# EAGLE board BMS_Master (EAGLE 6.6.0)
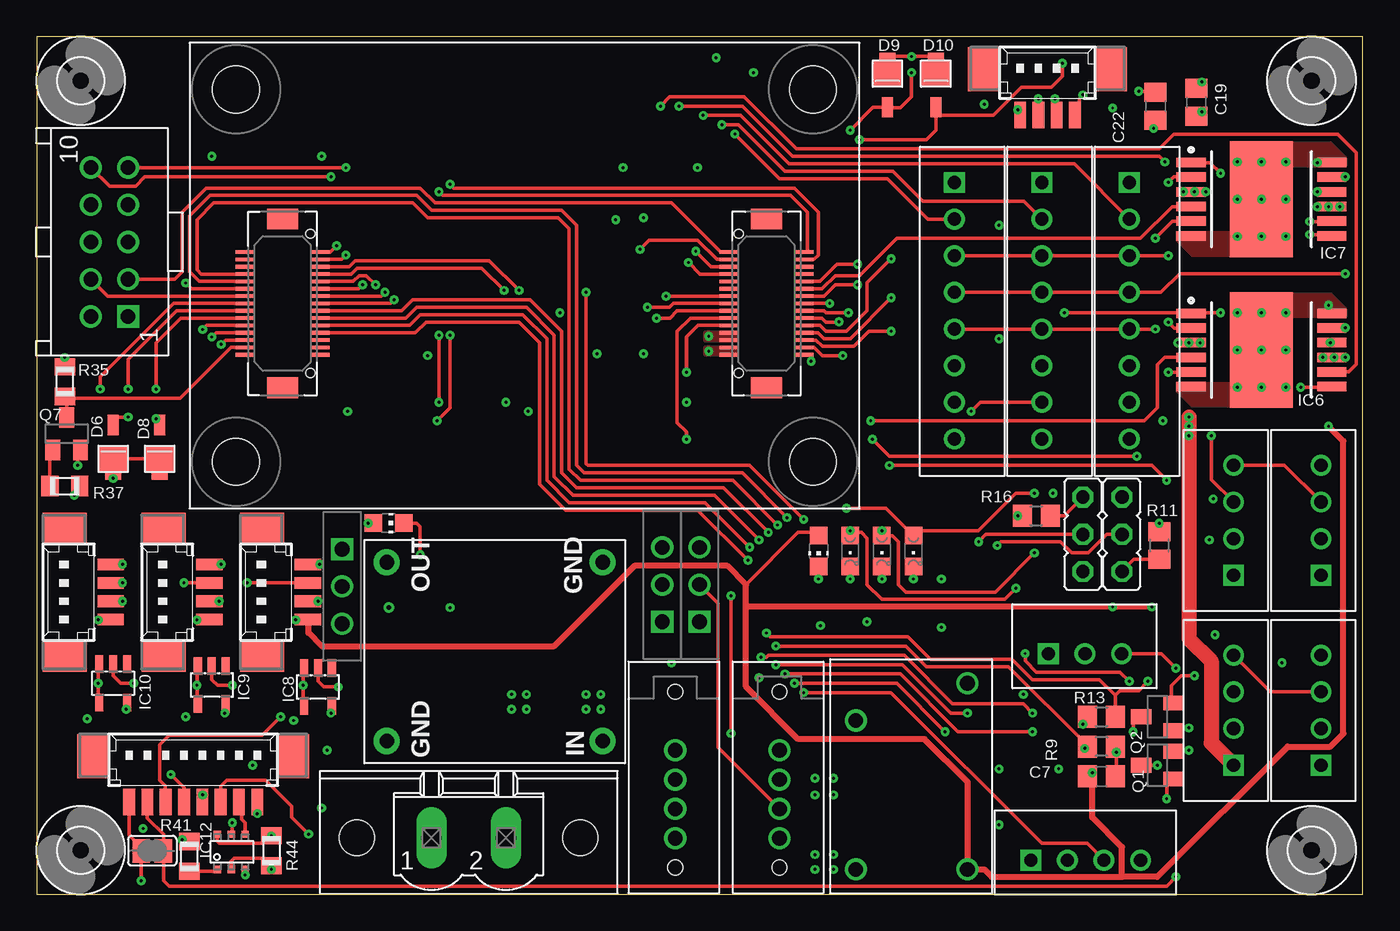
[diagram p6: board, top side]
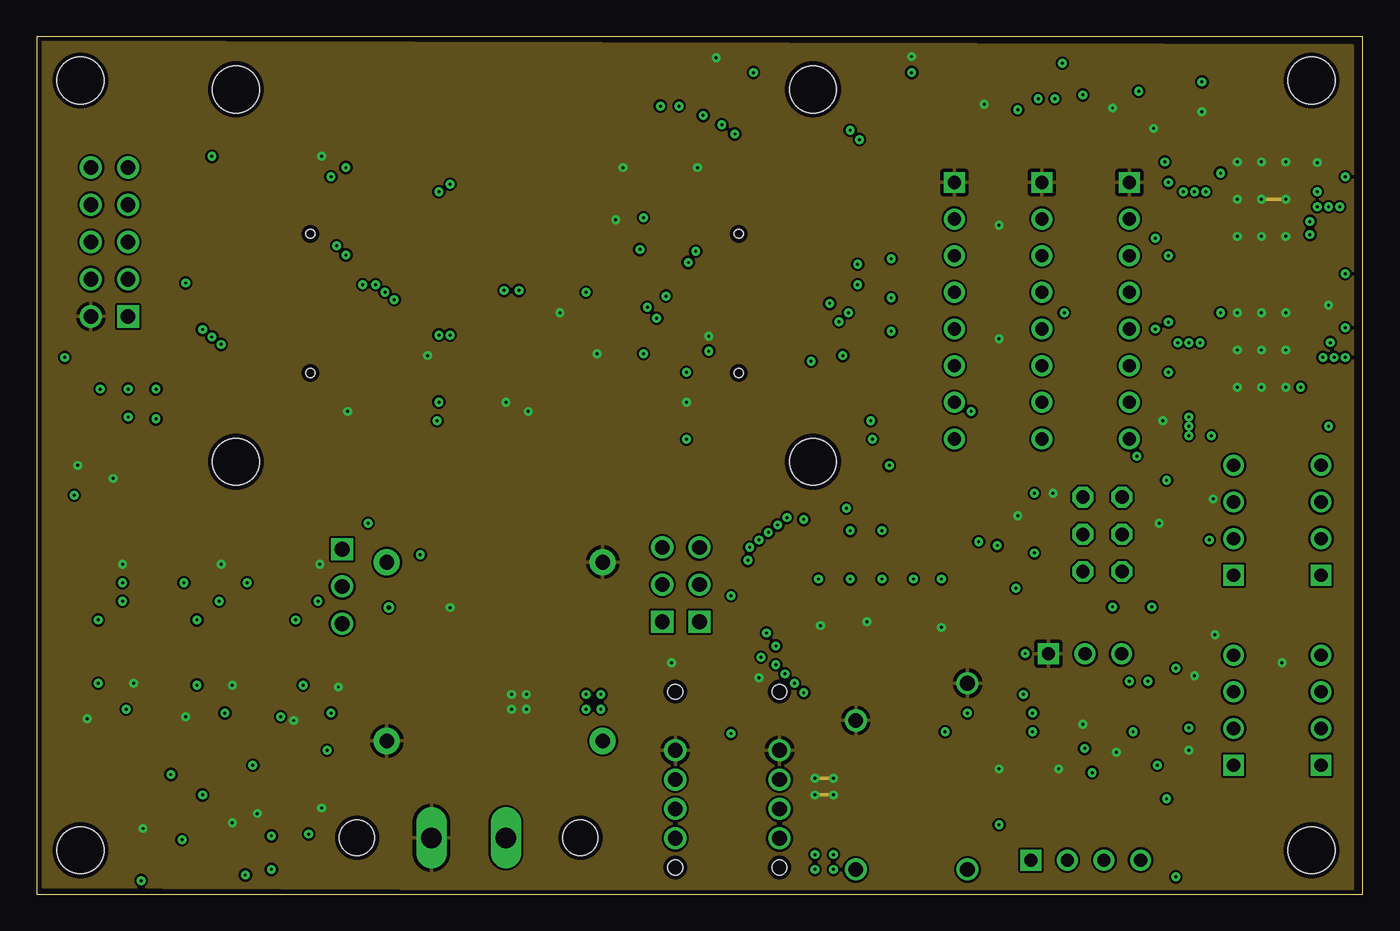
[diagram p7: board, inner layer Route2]
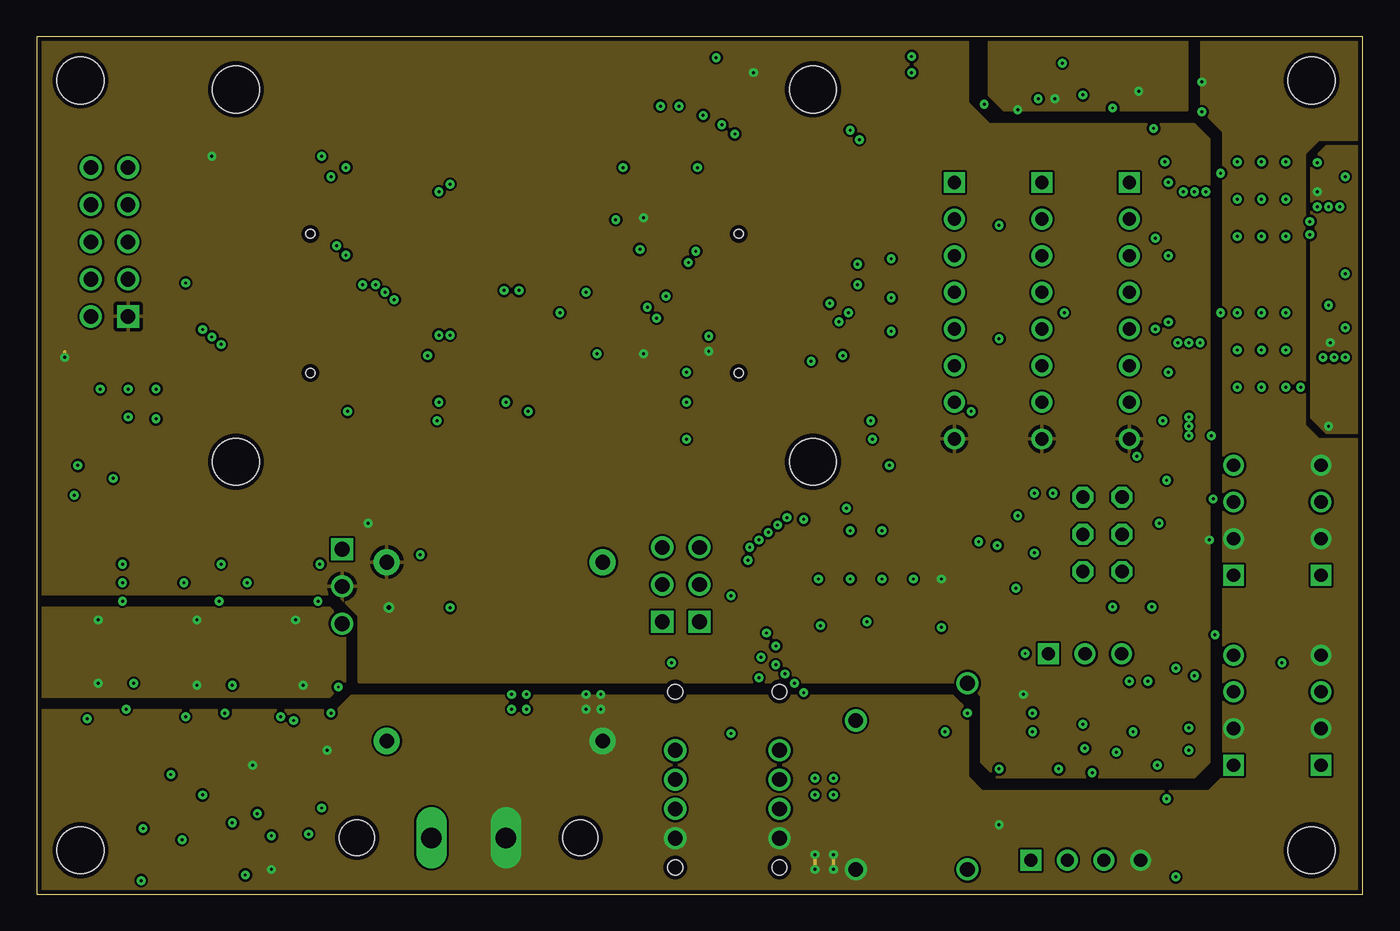
[diagram p8: board, inner layer Route15]
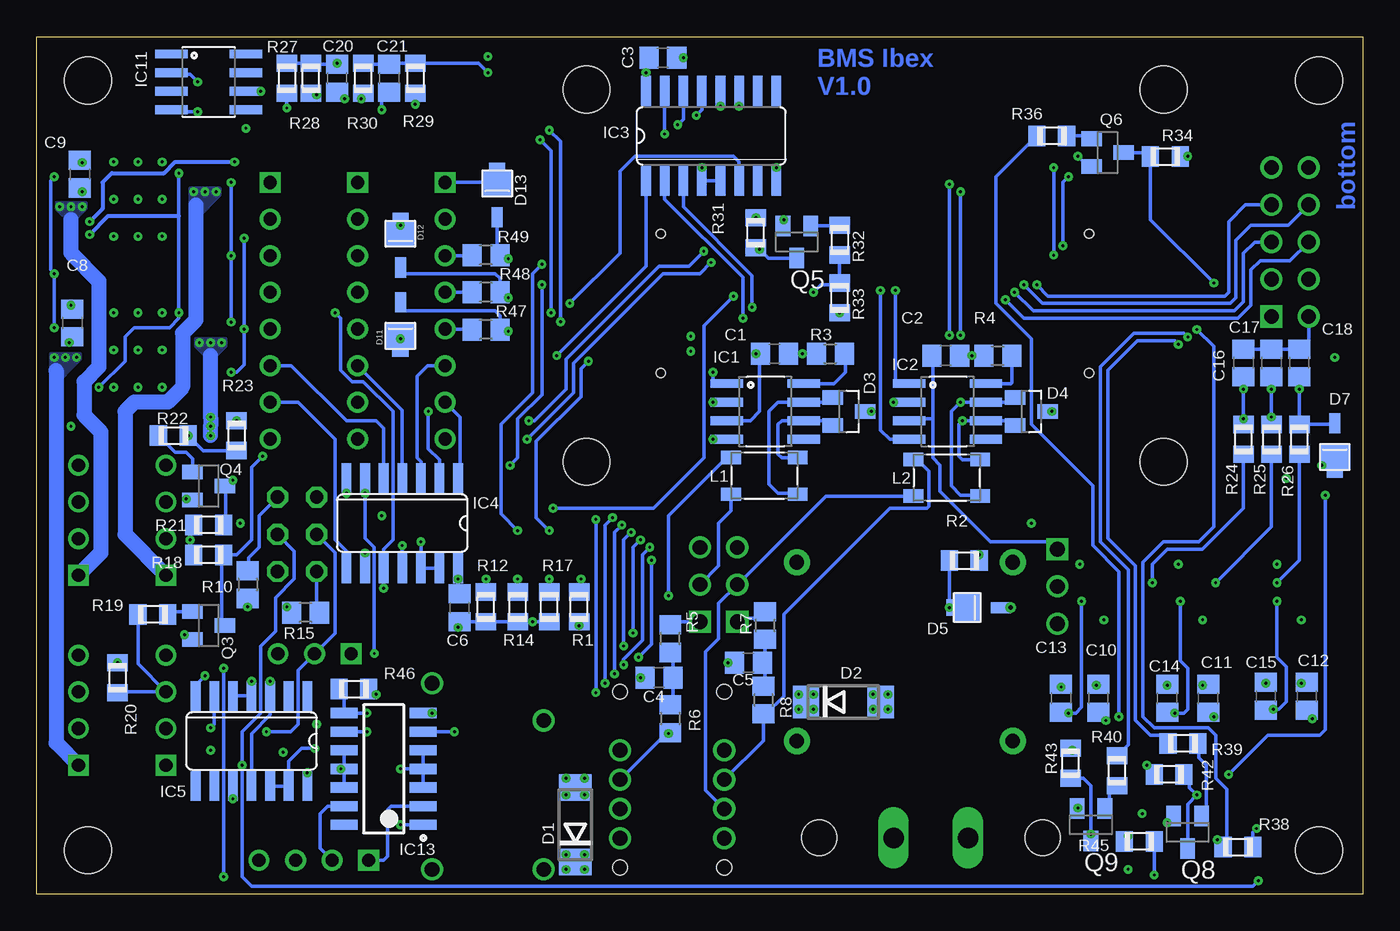
[diagram p9: board, bottom side, seen from below]

Size 90.5 x 58.5 mm. Coordinates in mm from the lower left corner, seen from the top.
Outline: 0,0 90.5,0 90.5,58.5 0,58.5 0,0
Copper layers (1+2*15+16): Top 0.035mm / dielectric 0.2mm / Route2 0.035mm / dielectric 0.5mm / Route15 0.035mm / dielectric 0.2mm / Bottom 0.035mm
Design rules "ats_35u_4layer *": minimum track width 6mil, minimum drill 0.2mm, track to track 6mil, track to pad 6mil, pad to pad 6mil, via to via 6mil, smd to smd 6mil, copper to edge 0.3mm, drill to drill 8mil, minimum pad ring 10mil, minimum via ring 0.2mm, stop-mask expansion 4mil, vias tented up to drill 0mil, thermal gap 10mil

## Footprints (pad centres in the part's own frame; a part is rotated, then mirrored left to right if it is on the bottom)
C0805 = smd 1.3 x 1.5: 1 -0.95,0; 2 0.95,0
53398-08 = smd 0.8 x 1.8: 1 4.375,-2.5; 2 3.125,-2.5; 3 1.875,-2.5; 4 0.625,-2.5; 5 -0.625,-2.5; 6 -1.875,-2.5; 7 -3.125,-2.5; 8 -4.375,-2.5 | smd 2.1 x 3: S1 6.875,0.625; S2 -6.875,0.625
DO214AA = smd 1.8 x 2.2: A 2.55,0; C -2.55,0
SOT23 = smd 1 x 1.4: 1 -0.95,-1.1; 2 0.95,-1.1; 3 0,1.1
SM2T3V3A = smd 1.82 x 2.03: P$1 -1.21,0 | smd 1.38 x 0.75: P$2 1.1,0 | smd 0.5 x 1.1: P$11 -2.37,0.005
3,2 = hole 3.2: 0,0
SO08 = smd 0.61 x 2.21: 1 -1.905,-2.616; 2 -0.635,-2.616; 3 0.635,-2.616; 4 1.905,-2.616; 5 1.905,2.616; 6 0.635,2.616; 7 -0.635,2.616; 8 -1.905,2.616
SO16 = smd 0.66 x 2.032: 1 -4.445,-3.073; 2 -3.175,-3.073; 3 -1.905,-3.073; 4 -0.635,-3.073; 5 0.635,-3.073; 6 1.905,-3.073; 7 3.175,-3.073; 8 4.445,-3.073; 9 4.445,3.073; 10 3.175,3.073; 11 1.905,3.073; 12 0.635,3.073; 13 -0.635,3.073; 14 -1.905,3.073; 15 -3.175,3.073; 16 -4.445,3.073
SO14 = smd 0.66 x 2.032: 1 -3.81,-3.073; 2 -2.54,-3.073; 3 -1.27,-3.073; 4 0,-3.073; 5 1.27,-3.073; 6 2.54,-3.073; 7 3.81,-3.073; 8 3.81,3.073; 9 2.54,3.073; 10 1.27,3.073; 11 0,3.073; 12 -1.27,3.073; 13 -2.54,3.073; 14 -3.81,3.073
INF-PG-DSO-12-11_N_1PRIMARY = smd 2 x 0.65: 1 -4.8,2.5; 2 -4.8,1.5; 3 -4.8,0.5; 4 -4.8,-0.5; 5 -4.8,-1.5; 6 -4.8,-2.5; 7 4.8,-2.5; 8 4.8,-1.5; 9 4.8,-0.5; 10 4.8,0.5; 11 4.8,1.5; 12 4.8,2.5 | smd 4.3 x 7.9: 13 0,0
SOT23-5L = smd 0.55 x 1.2: 1 -0.95,-1.3; 2 0,-1.3; 3 0.95,-1.3; 4 0.95,1.3; 5 -0.95,1.3
SO08' = smd 0.61 x 2.21: 1 -1.905,-2.54; 2 -0.635,-2.54; 3 0.635,-2.54; 4 1.905,-2.54; 5 1.905,2.54; 6 0.635,2.54; 7 -0.635,2.54; 8 -1.905,2.54
TSOP-6 = smd 0.5 x 0.5: P$1 0.25,-0.25; P$2 0.25,-1.2; P$3 0.25,-2.15; P$4 2.65,-2.15; P$5 2.65,-1.2; P$6 2.65,-0.25
INF-PG-DSO-14-22_M_1PRIMARY = smd 1.85 x 0.7: 1 -2.7,3.81; 2 -2.7,2.54; 3 -2.7,1.27; 4 -2.7,0; 5 -2.7,-1.27; 6 -2.7,-2.54; 7 -2.7,-3.81; 8 2.7,-3.81; 9 2.7,-2.54; 10 2.7,-1.27; 11 2.7,0; 12 2.7,1.27; 13 2.7,2.54; 14 2.7,3.81
JP2 = drill 0.914 octagon: 1 -2.54,0; 2 0,0; 3 2.54,0
ACT45B = smd 1.35 x 0.9: P$1 -0.675,0.45; P$2 3.875,0.45; P$3 -0.675,2.95; P$4 3.875,2.95
CHIP-LED0805 = smd 1.2 x 1.2: A 0,-1.05; C 0,1.05
CHIPLED_0805 = smd 1.2 x 1.2: A 0,-1.05; C 0,1.05
STM32F4_PROZESSORBOARD = smd 1.2 x 0.25: 1 3.75,10.47; 2 8.95,10.47; 3 3.75,10.97; 4 8.95,10.97; 5 3.75,11.47; 6 8.95,11.47; 7 3.75,11.97; 8 8.95,11.97; 9 3.75,12.47; 10 8.95,12.47; 11 3.75,12.97; 12 8.95,12.97; 13 3.75,13.47; 14 8.95,13.47; 15 3.75,13.97; 16 8.95,13.97; 17 3.75,14.47; 18 8.95,14.47; 19 3.75,14.97; 20 8.95,14.97; 21 3.75,15.47; 22 8.95,15.47; 23 3.75,15.97; 24 8.95,15.97; 25 3.75,16.47; 26 8.95,16.47; 27 3.75,16.97; 28 8.95,16.97; 29 3.75,17.47; 30 8.95,17.47; 31 41.97,17.47; 32 41.97,16.97; 33 41.97,16.47; 34 41.97,15.97; 35 41.97,15.47; 36 41.97,14.97; 37 41.97,14.47; 38 41.97,13.97; 39 41.97,13.47; 40 41.97,12.97; 41 41.97,12.47; 42 41.97,11.97; 43 41.97,10.97; 44 41.97,10.47; 45 36.77,10.47; 46 36.77,10.97; 47 36.77,11.47; 48 36.77,11.97; 49 36.77,12.47; 50 36.77,12.97; 51 36.77,13.47; 52 36.77,13.97; 53 36.77,14.47; 54 36.77,14.97; 55 36.77,15.47; 56 36.77,15.97; 57 36.77,16.47; 58 36.77,16.97; 59 36.77,17.47; 60 41.97,11.47 | smd 2.1 x 1.4: M1 6.35,8.22; M2 6.35,19.72; M3 39.37,8.22; M4 39.37,19.72 | hole 3.2: 3.175,3.175; 3.175,28.575; 42.545,28.575; 42.545,3.175 | hole 0.6: 8.25,9.22; 8.25,18.72; 37.47,18.72; 37.47,9.22
R0805 = smd 1.168 x 1.397: 1 -1.016,0; 2 1.016,0
R0805' = smd 1.3 x 1.5: 1 -0.95,0; 2 0.95,0
J_OR_S = drill 1: P$1 2.54,0; P$3 5.08,0 | drill 1 square: P$2 0,0
SJ = smd 1.168 x 1.6: 1 -0.762,0; 2 0.762,0
MAX16956_STEPDOWN6 = drill 1: GND 14.351,1.651; GND2 11.811,9.271; VIN 1.651,9.271; VOUT 1.651,1.651
MAX5035_STEPDOWN3 = drill 1 pad 1.778: GND@1 1.524,16.256; GND@2 13.716,1.524; VIN 1.524,1.524; VOUT 13.716,16.256
MSTBV2_GF = drill 1.397 long: 1 -2.54,0; 2 2.54,0 | hole 2.4: -7.62,0; 7.62,0
90130-1110 = drill 1 square: 1 -5.08,-1.27 | drill 1: 2 -5.08,1.27; 3 -2.54,-1.27; 4 -2.54,1.27; 5 0,-1.27; 6 0,1.27; 7 2.54,-1.27; 8 2.54,1.27; 9 5.08,-1.27; 10 5.08,1.27
CIOC_4-1-FV = drill 1: 1 0,0; 2 2,0; 3 4,0; 4 6,0 | hole 1: 8,0; -4,0
B8B-XH = drill 0.9 pad 1.422 square: P$1 0,0 | drill 0.9 pad 1.422: P$2 2.5,0; P$3 5,0; P$4 7.5,0; P$5 10,0; P$6 12.5,0; P$7 15,0; P$8 17.5,0
B3B-XH = drill 0.9 pad 1.422 square: P$1 0,0 | drill 0.9 pad 1.422: P$2 2.5,0; P$3 5,0
B4B-XH = drill 0.9 pad 1.422 square: P$1 0,0 | drill 0.9 pad 1.422: P$2 2.5,0; P$3 5,0; P$4 7.5,0
53398-04 = smd 0.8 x 1.8: 1 1.875,-2.5; 2 0.625,-2.5; 3 -0.625,-2.5; 4 -1.875,-2.5 | smd 2.1 x 3: S1 4.375,0.625; S2 -4.375,0.625

## Placement (x,y rotation side)
C1  100n  [C0805]  40.15,36.87 0 bottom
C2  100n  [C0805]  28.47,36.74 0 bottom
C3  100n  [C0805]  47.77,57.06 0 bottom
C4  47n  [C0805]  48.02,14.77 180 bottom
C5  47n  [C0805]  41.93,15.79 180 bottom
C6  100n  [C0805]  61.64,19.53 270 bottom
C7  100n  [C0805]  72.66,8.04 0 top
C8  100n  [C0805]  88.06,38.96 90 bottom
C9  100n  [C0805]  87.55,49.12 90 bottom
C10  100n  [C0805]  18.05,13.38 270 bottom
C11  100n  [C0805]  10.56,13.38 270 bottom
C12  100n  [C0805]  3.83,13.5 270 bottom
C13  100n  [C0805]  20.59,13.38 90 bottom
C14  100n  [C0805]  13.35,13.38 90 bottom
C15  100n  [C0805]  6.62,13.5 90 bottom
C16  100n  [C0805]  8.15,36.24 90 bottom
C17  100n  [C0805]  6.24,36.24 90 bottom
C18  100n  [C0805]  4.34,36.24 90 bottom
C19  1uF  [C0805]  79.14,54.02 270 top
C20  ?  [C0805]  70,55.67 90 bottom
C21  ?  [C0805]  66.44,55.67 90 bottom
C22  2,2uF  [C0805]  76.34,53.76 270 top
CON1  53398-08  [53398-08]  10.69,8.8 0 top
D1  18V  [DO214AA]  53.74,4.74 90 bottom
D2  18V  [DO214AA]  35.45,13.12 0 bottom
D3  NUP2105LT1G|SOT23  [SOT23]  35.07,32.93 270 bottom
D4  NUP2105LT1G|SOT23  [SOT23]  22.62,32.93 270 bottom
D5  SM2T3V3A  [SM2T3V3A]  25.81,19.55 0 bottom
D6  SM2T3V3A  [SM2T3V3A]  5.22,30.9 90 top
D7  SM2T3V3A  [SM2T3V3A]  1.92,31.03 90 bottom
D8  SM2T3V3A  [SM2T3V3A]  8.4,30.9 90 top
D9  SM2T3V3A  [SM2T3V3A]  58.06,54.78 270 top
D10  SM2T3V3A  [SM2T3V3A]  61.36,54.78 270 top
D11  SM2T3V3A  [SM2T3V3A]  65.68,39.28 90 bottom
D12  SM2T3V3A  [SM2T3V3A]  65.68,43.86 270 bottom
D13  SM2T3V3A  [SM2T3V3A]  59.07,47.28 270 bottom
H1  MOUNT-HOLE3.2  [3,2]  87,3 0 top
H2  MOUNT-HOLE3.2  [3,2]  3,3 0 top
H3  MOUNT-HOLE3.2  [3,2]  87,55.5 0 top
H4  MOUNT-HOLE3.2  [3,2]  3,55.5 0 top
IC1  SN65HVD230D  [SO08]  40.79,32.93 270 bottom
IC2  SN65HVD230D  [SO08]  28.34,32.93 270 bottom
IC3  74HC138D  [SO16]  44.47,51.73 0 bottom
IC4  4073D  [SO14]  65.55,25.31 180 bottom
IC5  4023D  [SO14]  75.84,10.46 180 bottom
IC6  TLE8102SGN  [INF-PG-DSO-12-11_N_1PRIMARY]  83.58,37.12 0 top
IC7  TLE8102SGN  [INF-PG-DSO-12-11_N_1PRIMARY]  83.58,47.41 0 top
IC8  1,8V  [SOT23-5L]  19.2,14.14 180 top
IC9  1,8V  [SOT23-5L]  11.96,14.27 180 top
IC10  1,8V  [SOT23-5L]  5.22,14.39 180 top
IC11  5V  [SO08']  78.76,55.41 270 bottom
IC12  BSL308C  [TSOP-6]  12.08,1.44 90 top
IC13  TLE4207GM  [INF-PG-DSO-14-22_M_1PRIMARY]  66.82,8.55 180 bottom
JP1  [JP2]  74.06,24.55 270 top
JP2  [JP2]  71.39,24.55 90 top
L1  ACT45B-510-2P-TL003  [ACT45B]  42.44,26.84 0 bottom
L2  ACT45B-510-2P-TL003  [ACT45B]  29.99,26.71 0 bottom
LED1  green  [CHIP-LED0805]  53.36,23.41 180 top
LED2  green  [CHIP-LED0805]  24.02,25.31 270 top
LED3  green  [CHIPLED_0805]  59.84,23.41 180 top
LED4  green  [CHIPLED_0805]  57.68,23.41 180 top
LED5  green  [CHIPLED_0805]  55.52,23.41 180 top
PROZ1  STM32F4_PROZESSORBOARDRPZ  [STM32F4_PROZESSORBOARD]  10.43,26.33 0 top
Q1  BSS205N  [SOT23]  76.47,8.8 90 top
Q2  BSS205N  [SOT23]  76.47,12.11 90 top
Q3  BSS205N  [SOT23]  78.76,18.33 270 bottom
Q4  BSS205N  [SOT23]  78.76,27.85 270 bottom
Q5  BSS205N  [SOT23]  38.63,44.49 180 bottom
Q6  BSS205N  [SOT23]  17.42,50.59 270 bottom
Q7  BSS205N  [SOT23]  2.05,31.41 0 top
Q8  BSS205N  [SOT23]  11.96,4.23 180 bottom
Q9  BSS205N  [SOT23]  18.56,4.74 180 bottom
R1  620R  [R0805]  53.48,19.6 90 bottom
R2  240R  [R0805]  27.2,22.77 0 bottom
R3  50k  [R0805']  36.34,36.87 0 bottom
R4  50k  [R0805']  24.91,36.74 0 bottom
R5  60R  [R0805']  47.26,17.44 90 bottom
R6  60R  [R0805']  47.26,11.98 270 bottom
R7  60R  [R0805']  40.79,18.33 90 bottom
R8  60R  [R0805']  40.91,13.25 270 bottom
R9  10k  [R0805']  72.66,10.07 180 top
R10  1k  [R0805']  76.09,21.12 270 bottom
R11  10k  [R0805']  76.6,23.79 270 top
R12  240R  [R0805]  59.84,19.6 90 bottom
R13  10k  [R0805']  72.66,12.11 0 top
R14  240R  [R0805]  57.68,19.6 90 bottom
R15  1k  [R0805']  72.15,19.22 180 bottom
R16  10k  [R0805']  68.22,25.82 0 top
R17  240R  [R0805]  55.52,19.6 90 bottom
R18  1K  [R0805]  78.76,23.16 180 bottom
R19  1K  [R0805]  82.57,19.09 180 bottom
R20  10K  [R0805]  84.98,14.77 270 bottom
R21  1K  [R0805]  78.76,25.19 180 bottom
R22  1K  [R0805]  81.17,31.28 0 bottom
R23  10K  [R0805]  76.85,31.28 270 bottom
R24  1K  [R0805]  8.15,31.03 90 bottom
R25  1K  [R0805]  6.24,31.03 90 bottom
R26  1K  [R0805]  4.34,31.03 90 bottom
R27  ?  [R0805]  73.42,55.67 270 bottom
R28  ?  [R0805]  71.77,55.67 90 bottom
R29  ?  [R0805]  64.66,55.67 270 bottom
R30  ?  [R0805]  68.22,55.67 90 bottom
R31  1K  [R0805]  41.42,45.13 90 bottom
R32  1K  [R0805]  35.7,44.62 270 bottom
R33  10K  [R0805]  35.7,40.68 90 bottom
R34  1K  [R0805]  13.48,50.33 0 bottom
R35  1K  [R0805]  1.92,34.97 90 top
R36  1K  [R0805]  21.23,51.73 180 bottom
R37  1K  [R0805]  1.92,27.85 0 top
R38  10K  [R0805]  8.53,3.22 0 bottom
R39  1K  [R0805]  12.27,10.28 180 bottom
R40  1K  [R0805]  16.78,8.42 90 bottom
R41  1K  [R0805]  10.43,2.58 90 top
R42  1K  [R0805]  13.23,8.17 180 bottom
R43  1K  [R0805]  19.96,8.93 90 bottom
R44  10K  [R0805]  16.02,2.96 270 top
R45  1K  [R0805]  15.26,3.6 180 bottom
R46  10K  [R0805]  68.85,14.01 0 bottom
R47  100R  [R0805']  59.84,38.52 180 bottom
R48  100R  [R0805']  59.84,41.06 180 bottom
R49  100R  [R0805']  59.84,43.6 180 bottom
S_CAN1  JUMPER_ORS  [J_OR_S]  20.85,23.54 270 top
S_CAN1_ROFF  JUMPER_ORS  [J_OR_S]  42.69,18.58 90 top
S_CAN2_ROFF  JUMPER_ORS  [J_OR_S]  45.23,18.58 90 top
SJ1  [SJ]  7.89,2.96 180 top
TB1  MAX16956_STEPDOWN6  [MAX16956_STEPDOWN6]  65.17,0.04 90 top
TERA-DC/DC1  [MAX5035_STEPDOWN3]  40.15,8.93 90 top
X1  [MSTBV2_GF]  29.48,3.85 0 top
X2  TERA-PROG-DEBUG-10GERADE  [90130-1110]  4.97,44.49 90 top
X3  CIOC_4-1-FV-A_CAN-BELEGUNG  [CIOC_4-1-FV]  50.69,9.82 270 top
X4  CIOC_4-1-FV-A_CAN-BELEGUNG  [CIOC_4-1-FV]  43.58,9.82 270 top
X5  B8B-XH  [B8B-XH]  62.63,48.55 270 top
X6  B8B-XH  [B8B-XH]  68.6,48.55 270 top
X7  B8B-XH  [B8B-XH]  74.57,48.55 270 top
X8  B3B-XH  [B3B-XH]  69.04,16.39 0 top
X9  B4B-XH  [B4B-XH]  81.68,8.8 90 top
X10  B4B-XH  [B4B-XH]  87.65,8.8 90 top
X11  B4B-XH  [B4B-XH]  81.68,21.76 90 top
X12  B4B-XH  [B4B-XH]  87.65,21.76 90 top
X13  53398-04  [53398-04]  16.02,20.62 90 top
X14  53398-04  [53398-04]  9.29,20.62 90 top
X15  53398-04  [53398-04]  2.56,20.62 90 top
X16  53398-04  [53398-04]  68.98,55.67 0 top
X17  B4B-XH  [B4B-XH]  67.84,2.33 0 top

## Tracks (layer width: path | path; a pad name or v marks a point on that pad's centre or on a via)
+3V3  (via drill 0.2, 0.3)
  Top 0.254: R35.2 v1.92,36.62 | LED2.A v22.62,25.31
  Route15 0.254: v1.92,36.62 1.92,37
  Bottom 0.254: D5.P$2 v24.03,19.55 | IC1.3 41.8,32.3 41.17,32.93 41.17,36.8 C1.1 v41.42,36.87 | IC3.16 v48.91,56.05 48.91,56.87 C3.1 | R34.2 v11.96,50.33 | v61.74,21.5 IC4.14 61.74,20.58 C6.1 | R18.2 80.03,23.41 v80.03,24.17 80.03,25.44 R21.2 | v67.33,13.63 67.45,13.63 R46.2
  other vias: 45.87,37.05 41.42,46.14
  pour Route15: 0,20.5 20.5,20.5 22,19 22,14.5 63.5,14.5 64.5,13.5 64.5,9 65.5,8 79,8 80,9 80,51.5 79,52.5 65,52.5 63.5,54 63.5,58.5 0,58.5
  pour Top (no thermals): 47.82,36.79 45.61,36.79 45.61,37.3 47.82,37.3
+5V  (via drill 0.2)
  Top 0.254: IC6.10 88.38,37.63 v88.28,37.63 | IC10.4 4.21,13.16 v4.21,14.39 4.21,15.63 IC10.3 | IC9.4 10.94,13.03 v10.94,14.27 10.94,15.5 IC9.3 | IC8.3 18.18,15.37 v18.18,14.27 18.18,12.9 IC8.4 | X13.4 17.83,18.74 17.8,18.71 v17.67,18.71 | X14.4 11.22,18.74 11.19,18.71 v10.94,18.71 | X15.4 4.37,18.74 4.34,18.71 v4.21,18.71 | v87.39,47.92 88.38,47.92 IC7.10 | 53.74,24.68 53.58,24.68 | 53.58,24.68 LED1.A | 53.58,24.68 51.96,24.68 48.41,21.12
  Top 0.406: 74.06,1.18 65.17,1.18 64.66,1.69 TB1.VOUT 63.52,7.66 60.6,10.58 51.96,10.58 48.41,14.14 48.41,19.73 | v88.16,31.92 89.17,30.9 89.17,10.96 88.28,10.07 85.36,10.07 76.47,1.18 74.06,1.18 | C7.1 71.77,8.04 v72.03,8.3 72.03,5.25 74.06,3.22 74.06,1.18 | 48.41,19.73 48.41,21.12 47.13,22.39 40.79,22.39 35.32,16.93 19.45,16.93 18.56,17.82 18.56,18.7 X13.4 | 48.41,19.73 48.53,19.6 v73.42,19.6 v76.09,19.6
  Bottom 0.254: 4.02,14.45 C12.1 3.89,14.39 v4.21,14.39 | C11.1 10.88,14.33 v10.94,14.27 | v88.28,37.63 87.68,37.63 C8.1 | C9.1 87.65,48.17 v87.39,47.92 | v72.03,8.3 IC5.14 | R15.2 73.1,19.28 v73.42,19.6 | v18.18,14.27 18.11,14.27 C10.1
  Bottom 0.406: v76.09,19.6 R10.2
  pour Route15: 20,13.5 0,13.5 0,19.5 20,19.5 21,18.5 21,14.5
  pour Route15: 90.5,31.5 88,31.5 87,32.5 87,50 88,51 90.5,51
CAN1_H
  Bottom 0.254: X4.3 44.85,7.09 44.85,16.55 43.96,17.44 43.96,19.85 S_CAN1_ROFF.P$1 36.65,27.16 L2.P$1
CAN1_L
  Bottom 0.254: L2.P$3 30.38,29.38 30.12,29.38 29.61,28.87 29.61,26.46 29.74,26.33 32.28,26.33 39.52,19.09 39.52,13.5 40.72,12.3 R8.2 40.91,10.49 X4.2
CAN1_RXD  (via drill 0.2)
  Top 0.254: v32.91,41.19 30.88,43.22 21.73,43.22 21.31,42.8 PROZ1.26
  Bottom 0.254: IC2.4 32.28,31.03 32.91,31.66 v32.91,41.19
CAN1_TXD  (via drill 0.2)
  Top 0.254: v31.89,41.19 30.37,42.71 21.86,42.71 21.45,42.3 PROZ1.24
  Bottom 0.254: v31.89,41.19 31.89,34.79 31.01,34.79 IC2.1
CAN2_H
  Top 0.254: S_CAN2_ROFF.P$1 46.5,19.85 46.5,10.01 X3.3
  Bottom 0.254: L1.P$1 43.11,26.16 43.96,25.31 43.96,22.39 S_CAN2_ROFF.P$1
CAN2_H0
  Bottom 0.254: D3.1 36.48,33.57 IC1.7 39.9,33.57 40.53,32.93 40.53,27.98 39.9,27.35 38.62,27.35 L1.P$2
CAN2_L  (via drill 0.2)
  Top 0.254: v47.39,20.36 v47.39,10.96
  Bottom 0.254: X3.2 47.48,11.03 R6.2 47.39,10.9 v47.39,10.96 | L1.P$3 43.42,29.79 47.39,25.82 v47.39,20.36
CAN2_L0
  Bottom 0.254: D3.2 36.48,32.3 IC1.6 39.64,32.3 39.9,32.04 39.9,30.01 39.64,29.76 38.59,29.76 L1.P$4
CAN2_RXD  (via drill 0.2)
  Top 0.254: PROZ1.50 44.61,39.3 43.71,38.39 43.71,32.17 44.34,31.54 v44.34,31.03
  Bottom 0.254: v44.34,31.03 IC1.4
CAN2_TXD  (via drill 0.2)
  Top 0.254: PROZ1.49 45.13,38.8 44.34,38.01 v44.34,35.6
  Bottom 0.254: v44.34,35.6 44.34,34.84 IC1.1
CANP_H  (via drill 0.2)
  Top 0.254: PROZ1.31 52.6,43.8 52.6,46.52 51.45,47.67 27.7,47.67 v27.45,47.92 | v27.45,38.14 v27.45,33.57
  Bottom 0.254: L2.P$2 26.17,27.22 27.45,27.22 28.09,27.85 28.09,32.93 v27.45,33.57 IC2.7 24.04,33.57 D4.1 | v27.45,47.92 v27.45,38.14
CANP_L  (via drill 0.2)
  Top 0.254: PROZ1.32 53.06,43.3 53.36,43.6 53.36,46.52 51.71,48.17 28.47,48.17 v28.21,48.43 | v28.21,38.14 28.21,33.19 v27.32,32.3
  Bottom 0.254: L2.P$4 26.14,29.63 27.32,29.63 27.58,29.89 27.58,32.04 v27.32,32.3 IC2.6 24.04,32.3 D4.2 | v28.21,48.43 v28.21,38.14
CH_DI3_EX  (via drill 0.2)
  Top 0.254: CON1.3 12.56,7.38 12.97,7.79 15.64,7.79 17.42,6.01 17.42,5.25 v18.56,4.11
  Bottom 0.254: Q9.3 v18.56,4.11 18.56,7.41 19.07,7.92 R43.1
CH_DI4_EX  (via drill 0.2)
  Top 0.254: v11.32,6.77 v11.31,6.76 CON1.4
  Bottom 0.254: R42.1 11.83,7.79 11.83,7.28 v11.32,6.77 11.96,6.14 Q8.3
CH_DO2_EX  (via drill 0.2)
  Top 0.254: CON1.6 8.78,6.33 8.78,7.41 8.4,7.79 8.4,10.2 9.04,10.84 15.39,10.84 v16.66,12.11
  Bottom 0.254: v16.66,12.11 16.66,22.01 18.43,23.79 18.43,27.85 22.62,32.04 22.62,37.89 25.04,40.3 25.04,48.94 R36.2
CH_FLT_EX  (via drill 0.2)
  Top 0.254: v9.16,8.17 10.06,7.27 CON1.5 | v2.56,27.22 2.56,27.47 R37.2
  Bottom 0.254: v2.56,27.22 2.56,11.22 2.94,10.84 6.5,10.84 v9.16,8.17
CH_NDI3  (via drill 0.2)
  Top 0.254: v11.96,38.01 12.24,38.3 PROZ1.7
  Bottom 0.254: R40.2 16.02,10.2 16.02,22.14 17.93,24.04 17.93,35.98 15.64,38.27 12.21,38.27 v11.96,38.01
CH_NDI4  (via drill 0.2)
  Top 0.254: v12.59,37.51 12.89,37.8 PROZ1.5
  Bottom 0.254: R39.2 13.29,10.39 13.73,10.84 14.5,10.84 15.51,11.85 15.51,22.39 17.42,24.3 17.42,35.73 15.39,37.76 12.85,37.76 v12.59,37.51
CH_NDO2  (via drill 0.2)
  Top 0.254: PROZ1.19 10.58,41.3 v10.18,41.7
  Bottom 0.254: 14.88,50.84 14.5,50.46 R34.1 | v10.18,41.7 14.5,46.01 R34.1 | Q6.3 14.5,50.59 R34.1
CH_NFLT
  Top 0.254: 2.05,33.82 9.8,33.82 13.27,37.3 PROZ1.3 | Q7.3 2.05,33.82 | 2.05,33.82 R35.1
CH_PON  (via drill 0.2)
  Top 0.254: v11.32,38.52 11.6,38.8 PROZ1.9 | v9.92,3.72 10.31,3.72 R41.2
  Bottom 0.254: 9.29,3.72 9.29,7.15 10.05,7.92 10.05,10.84 10.56,11.34 14.24,11.34 15,12.11 15,22.65 13.61,24.04 11.19,24.04 10.18,25.06 10.18,37.38 v11.32,38.52 | 9.16,3.09 9.29,3.09 9.29,3.22 | 9.29,3.22 9.29,3.72 | 9.29,3.72 v9.92,3.72 | R38.1 9.29,3.22
CH_PON_EX
  Top 0.254: IC12.P$4 14.23,4.88 13.99,5.12 13.99,6.13 CON1.2
CS_B0  (via drill 0.2)
  Top 0.254: v55.01,36.74 53.61,36.74 53.06,37.3 PROZ1.43
  Bottom 0.254: 49.04,49.57 48.91,49.44 IC3.1 48.91,42.84 v55.01,36.74
CS_B1  (via drill 0.2)
  Top 0.254: v42.31,39.28 v42.32,39.29 43.21,39.29 43.71,39.8 PROZ1.51
  Bottom 0.254: IC3.2 47.64,47.41 42.31,42.08 v42.31,39.28
CS_B2  (via drill 0.2)
  Top 0.254: v41.67,40.05 43.2,40.05 43.45,40.3 PROZ1.52
  Bottom 0.254: IC3.3 46.37,46.9 41.67,42.2 v41.67,40.05
GND  (via drill 0.2)
  Top 0.254: IC7.13 83.58,49.19 84.31,49.91 | IC7.6 78,44.91 78,44.87 | X15.1 4.75,22.49 4.72,22.52 v5.86,22.52 | X14.1 11.61,22.49 11.58,22.52 v12.59,22.52 | X13.1 18.08,22.49 18.05,22.52 v19.32,22.52 | IC8.2 19.2,14.52 19.58,14.14 v20.59,14.14 | IC9.2 11.96,14.65 12.34,14.27 v13.35,14.27 | IC10.2 5.22,14.9 5.73,14.39 v6.62,14.39 | v2.81,29.25 2.81,29.87 3,30.06 Q7.2 | CON1.1 v15.06,5.5 | C22.2 76.22,52.68 v76.22,52.24 | 88.34,49.95 IC7.12 v87.39,49.91 | R11.1 v76.6,25.31 | R16.1 v66.95,25.82 | v79.01,14.9 78.12,14.9 77.45,14.22 77.45,13.18 Q2.2 | C7.2 73.61,8.61 73.68,8.68 v73.68,9.69 73.68,10.01 R9.1 | 71.71,11.79 R13.1 71.39,11.79 v71.39,11.6 | D6.P$11 | D6.P$11 D6.P$1 | D6.P$1 4.99,29.93 | D6.P$11 v5.22,28.36 | D6.P$1 D8.P$1 D8.P$11 | D10.P$1 D10.P$11 v59.71,57.15 D9.P$11 D9.P$1 | v13.35,4.87 13.35,4.16 IC12.P$5 | Q1.2 78.06,9.75 78.12,9.82 v78.63,9.82 | C19.2 79.2,53.07 v79.52,53.38 | 78.74,34.58 IC6.6 | v88.16,40.17 88.16,39.79 88.32,39.62 IC6.12
  Route2 0.254: v53.1,6.77 v54.37,6.77 | v54.37,7.92 v53.1,7.92 | v85.23,47.41 IC7.13 | 59.71,57.19 v59.71,57.15
  Bottom 0.254: v33.42,13.63 32.9,13.63 D2.A | 27.97,19.56 D5.P$11 v28.22,19.55 | v28.22,19.55 D5.P$1 | D3.3 v33.55,32.93 | IC1.2 v44.34,33.57 | R3.1 v38.24,36.87 C1.2 | R4.1 v26.69,36.74 C2.2 | 21.27,32.89 v21.23,32.93 D4.3 | IC2.2 v32.02,33.57 | D1.A 53.22,6.77 v53.1,6.77 | v54.37,6.77 v54.37,7.92 | IC3.5 IC3.4 v45.1,49.57 | v6.62,14.39 6.56,14.39 C15.2 | v13.35,14.27 13.29,14.27 C14.2 | v20.59,14.14 20.4,14.14 C13.2 | C16.2 C17.2 C18.2 4.27,37.12 3.7,37.12 X2.2 | 39.92,48.66 IC3.8 v40.02,49.57 | C3.2 v46.37,57.06 | 12.59,5.12 12.59,5.14 12.85,5.14 | 12.85,5.14 13.08,5.14 v13.35,4.87 | R27.2 v73.42,53.63 | R29.2 v64.66,53.89 | R38.2 7.51,4.23 v7.26,4.49 | IC13.11 v69.74,8.55 | IC13.4 v65.68,8.55 | IC13.4 IC13.5 | IC13.3 IC13.4 | IC13.12 IC13.11 | IC13.11 IC13.10 | 87.26,50.07 87.14,49.95 87.39,49.95 v87.39,49.91 v87.39,49.92 C9.2 | R17.1 R14.1 | R14.1 v56.66,18.58 | R14.1 R12.1 61.61,18.58 | IC5.7 79.65,14.27 v79.01,14.9 | D7.P$11 D7.P$1 2.49,29.25 v2.81,29.25 | D12.P$1 v65.68,45.63 D12.P$11 65.67,45.76 | D13.P$11 D13.P$1 59.13,48.55 X5.P$1 | v79.52,53.38 81.17,53.38 IC11.4 | C5.2 v43.33,15.79 | C4.2 v49.29,14.77 | R2.1 v28.21,19.56 v28.22,19.55 | R1.1 v53.48,18.33 | Q6.2 18.75,49.64 v19.45,50.33 | Q8.2 12.78,5.21 12.85,5.14 | Q5.2 39.52,45.65 v39.52,46.01 | Q3.2 80.09,17.38 v80.41,17.69 | v88.16,40.17 88.06,40.07 C8.2 | v17.54,11.85 17.54,11.92 C10.2 | v10.18,12.11 10.24,12.11 C11.2 | v61.74,18.2 61.74,18.48 C6.2 | v3.45,11.98 3.45,12.17 C12.2 | v69.36,27.35 IC4.7 | D11.P$11 v65.68,37.88 v65.68,37.89 D11.P$1 | v19.45,5.88 19.47,5.88 Q9.2
  Bottom 0.279: Q4.2 80.22,26.9 v80.28,26.96
  other vias: 45.87,38.06 33.42,12.61 32.4,12.61 32.4,13.63 81.93,49.95 81.93,47.41 81.93,44.87 83.58,44.87 85.23,44.87 83.58,47.41 85.23,49.95 83.58,49.95 81.93,37.12 83.58,37.12 85.23,37.12 81.93,34.58 83.58,34.58 85.23,34.58 81.93,39.66 83.58,39.66 85.23,39.66 35.7,39.66 84.98,15.79 76.85,32.3
  pour Top (no thermals): 47.82,37.76 45.61,37.76 45.61,38.32 47.82,38.32
  pour Route2: 0.44,0.5 0.19,58.13 89.76,57.88 89.76,0.12
  pour Top (no thermals): 84.85,51.22 88.28,51.22 89.3,50.21 89.3,49.7 84.85,49.7
  pour Top (no thermals): 82.31,43.6 78.89,43.6 77.87,44.62 77.87,45.13 82.31,45.13
  pour Top (no thermals): 84.98,40.93 88.28,40.93 89.3,39.92 89.3,39.41 84.98,39.41
  pour Top (no thermals): 82.31,33.31 78.89,33.31 77.87,34.33 77.87,34.84 82.31,34.84
HS_CO1
  Top 0.254: 78.65,46.78 IC7.4 78.78,46.9 77.49,46.9 75.33,44.74 58.69,44.74 56.15,42.2 54.5,42.2 53.6,41.3 PROZ1.36
HS_RM  (via drill 0.2)
  Top 0.254: PROZ1.37 53.73,40.8 54.5,41.57 v56.02,41.57 | v58.18,29.25 76.09,29.25 v77.11,28.23
  Bottom 0.254: v56.02,41.57 56.02,34.08 57.68,32.43 57.68,29.76 v58.18,29.25 | Q4.3 77.61,27.81 77.61,25.7
  Bottom 0.279: 77.61,25.7 77.61,25.31 R21.1 | Q4.3 77.49,27.85 v77.11,28.23
HS_RM_EX  (via drill 0.2)
  Top 0.254: R22.2 80.16,28.28 X11.P$3
  Bottom 0.254: R23.2 79.14,30.27 R22.2
  other vias: 80.16,31.28
IL1  (via drill 0.2)
  Top 0.254: PROZ1.14 24.92,39.8 25.67,40.55 33.67,40.55 35.83,38.39 35.83,28.74 36.85,27.73 46.88,27.73 v49.93,24.68 | v50.44,16.93 59.33,16.93 60.72,15.54 66.31,15.54 71.52,10.33 v71.52,9.95 71.58,9.95 R9.2
  Bottom 0.254: IC5.12 IC5.13 73.3,9.06 72.41,9.95 v71.52,9.95 | v49.93,24.68 50.44,24.17 v50.44,16.93
IL2  (via drill 0.2)
  Top 0.254: PROZ1.12 25.18,39.3 25.93,40.05 33.42,40.05 35.32,38.14 35.32,28.49 36.59,27.22 46.25,27.22 v49.29,24.17 | v49.8,17.82 50.06,17.57 59.45,17.57 60.98,16.04 66.57,16.04 67.96,14.65 72.53,14.65 73.61,13.56 | R13.2 73.61,13.56 | 73.61,13.56 73.93,13.88 75.2,13.88 v75.84,14.52
  Bottom 0.254: IC5.5 IC5.4 v75.84,14.52 | v49.29,24.17 49.8,23.66 v49.8,17.82
ILK1  (via drill 0.2)
  Top 0.254: CON1.8 6.31,4.04 6.75,3.6 6.75,3.34 SJ1.2 v7.13,0.93 | JP1.2 73.04,24.55 71.77,23.28 70.63,23.28 69.87,24.04 65.8,24.04 v65.55,23.79 | 75.2,8.85 75.2,8.8 Q1.3 75.58,8.8 v76.47,8.8
  Bottom 0.254: v7.13,0.93 7.51,0.55 75.84,0.55 76.47,1.18 v76.47,8.8 76.47,11.09 75.2,12.36 75.2,16.93 74.19,17.95 74.19,20.23 72.92,21.5 72.92,23.41 JP1.2 | v65.55,23.79 IC4.11
ILK1_CH  (via drill 0.2)
  Top 0.254: CON1.7 7.56,5.2 8.65,4.11 SJ1.1 8.65,0.93 9.04,0.55 77.11,0.55 v77.74,1.18 | X8.P$3 76.75,16.39 v77.74,15.41
  Bottom 0.254: v77.74,15.41 v77.74,1.18
ILK2  (via drill 0.2)
  Top 0.254: JP2.2 64.79,24.55 v64.28,24.04 | v74.82,11.09 74.82,11.94 74.99,12.11 Q2.3
  Bottom 0.254: v64.28,24.04 IC4.12 IC4.13 | JP2.2 70.12,23.28 70.12,17.81 X8.P$2 72.66,15.27 72.66,11.6 73.17,11.09 v74.82,11.09
INTERLOCK_OK  (via drill 0.2)
  Top 0.254: 78.89,50.01 IC7.1 80.07,49.91 v80.79,49.19 | v80.79,39.66 78.82,39.66 IC6.1 78.7,39.54 78.25,39.54 78.12,39.66 v70.12,39.66 | v86.89,45 88.3,45 IC7.7 | v86.25,34.58 88.34,34.58 IC6.7 | LED5.A v55.52,24.81 55.64,24.68 56.28,24.68 56.66,24.3 56.66,21.12 57.68,20.11 66.06,20.11 v66.82,20.87 | v52.85,36.36 52.85,36.8 PROZ1.44
  Bottom 0.254: v80.79,49.19 80.79,46.27 v80.79,39.66 80.79,39.28 81.42,38.65 83.84,38.65 84.47,38.01 84.47,36.36 v86.25,34.58 | v55.52,24.81 56.41,25.7 56.41,30.9 53.36,33.95 53.36,35.85 v52.85,36.36 | v66.82,20.87 IC4.10 66.82,23.54 66.19,24.17 66.19,32.93 68.22,34.97 68.98,34.97 69.74,35.73 69.74,39.28 v70.12,39.66
  Bottom 0.279: v86.89,45 85.62,46.27 80.79,46.27
JTCK  (via drill 0.2)
  Top 0.254: PROZ1.18 23.5,40.8 v23.77,41.06
  Bottom 0.254: v23.77,41.06 22.5,39.79 8.78,39.79 8.15,40.43 8.15,43.73 7.38,44.49 X2.5
JTDI  (via drill 0.2)
  Top 0.254: PROZ1.16 24.15,40.3 v24.4,40.55
  Bottom 0.254: X2.6 4.97,43.22 7,43.22 7.64,42.59 7.64,40.17 8.53,39.28 23.13,39.28 v24.4,40.55
JTDO  (via drill 0.2)
  Top 0.254: PROZ1.20 21.97,41.3 v22.24,41.57
  Bottom 0.254: X2.7 8.02,47.03 9.16,45.89 9.16,41.06 9.42,40.81 21.48,40.81 v22.24,41.57
JTMS
  Top 0.254: PROZ1.59 46.68,43.8 43.33,47.16 27.2,47.16 26.18,48.17 11.58,48.17 9.92,46.52 9.92,42.46 9.42,41.95 X2.3
JTNRST  (via drill 0.2)
  Top 0.254: PROZ1.22 21.58,41.8 21.99,42.2 22.5,42.2 v23.13,41.57
  Bottom 0.254: X2.8 5.1,45.63 7.64,45.63 8.65,44.62 8.65,40.68 9.04,40.3 21.86,40.3 v23.13,41.57
LEM_1  (via drill 0.2)
  Top 0.254: PROZ1.15 9.35,40.3 C18.1 v4.34,34.46
  Bottom 0.254: C18.1 v4.34,34.46 R26.2 2.01,32.04 D7.P$2
LEM_2  (via drill 0.2)
  Top 0.254: v6.24,34.46 6.24,36.49 9.55,39.8 PROZ1.13 | D6.P$2 5.35,32.13 5.35,32.55 v6.24,32.55
  Bottom 0.254: C17.1 v6.24,34.46 v6.24,32.55 R25.2
LEM_3  (via drill 0.2)
  Top 0.254: PROZ1.11 9.81,39.3 8.15,37.63 v8.15,34.46 | 8.53,32.43 v8.15,32.43 R24.2 8.19,32 D8.P$2
  Bottom 0.254: C16.1 v8.15,34.46 R24.2 v8.15,32.43
LK_1  (via drill 0.2)
  Top 0.254: PROZ1.23 11.23,42.3 10.94,42.59 10.94,46.01 12.08,47.16 25.67,47.16 26.69,46.14 35.58,46.14 36.34,45.38 36.34,29 37.1,28.23 47.52,28.23 v50.56,25.19 | v51.07,15.03 58.95,15.03 62.88,11.09 v67.96,11.09
  Bottom 0.254: v50.56,25.19 51.07,24.68 v51.07,15.03 | v67.96,11.09 IC13.9
LK_2  (via drill 0.2)
  Top 0.254: PROZ1.21 11.09,41.8 10.43,42.46 10.43,46.27 11.83,47.67 25.93,47.67 26.94,46.65 35.83,46.65 36.85,45.63 36.85,29.25 37.36,28.74 48.15,28.74 v51.2,25.7 | v51.71,14.39 58.69,14.39 v61.99,11.09
  Bottom 0.254: v51.2,25.7 51.71,25.19 v51.71,14.39 | v61.99,11.09 IC13.6
LK_EF  (via drill 0.2)
  Top 0.254: PROZ1.8 25.83,38.3 26.56,39.03 32.91,39.03 34.31,37.63 34.31,27.98 36.09,26.2 45.1,26.2 v48.53,22.77 | v67.96,12.36 67.33,13 62.5,13 59.2,16.3 49.93,16.3 49.8,16.17 v49.42,16.17
  Bottom 0.254: v49.42,16.17 48.53,17.06 v48.53,22.77 | R46.1 69.52,13.66 IC13.8 v67.96,12.36
LK_ON  (via drill 0.2)
  Top 0.254: PROZ1.10 25.44,38.8 26.18,39.54 33.16,39.54 34.82,37.89 34.82,28.23 36.34,26.71 45.61,26.71 v48.66,23.66 | v50.44,15.66 59.07,15.66 62.38,12.36 v63.52,12.36
  Bottom 0.254: v48.66,23.66 49.17,23.16 49.17,17.31 50.44,16.04 v50.44,15.66 | v63.52,12.36 IC13.7
LK_RM  (via drill 0.2)
  Top 0.254: PROZ1.58 46.42,43.3 45.1,44.62 41.8,44.62 v41.17,43.98
  Bottom 0.254: v41.17,43.98 41.04,43.98 | Q5.3 40.57,43.39 v41.17,43.98 | R31.1 41.29,44.11 v41.17,43.98
MISO  (via drill 0.2)
  Top 0.254: v89.3,48.94 89.28,48.91 IC7.11 | IC6.11 88.41,38.65 v89.3,38.65 | v89.3,42.33 78,42.33 76.72,41.05 X7.P$4 X6.P$4 X5.P$4
  Bottom 0.254: X5.P$4 R48.2 | v89.3,48.94 89.55,48.68 89.55,42.59 v89.3,42.33 v89.3,38.65
MISO_S  (via drill 0.2)
  Top 0.254: PROZ1.42 53.33,38.3 53.74,37.89 55.52,37.89 v58.31,40.68
  Bottom 0.254: 58.56,41.06 R48.1 | R48.1 58.88,42.02 59.2,42.33 65.68,42.33 D12.P$2 | v58.31,40.68 58.5,40.68 R48.1
MOSI  (via drill 0.2)
  Top 0.254: v77.23,48.55 77.61,48.94 78.76,48.94 IC7.2 | IC6.2 77.64,38.62 v77.23,39.03 | X5.P$3 X6.P$3 X7.P$3 v77.23,43.55
  Bottom 0.254: v77.23,39.03 v77.23,43.55 v77.23,48.55 | X5.P$3 60.83,43.55 R49.2
MOSI_S  (via drill 0.2)
  Top 0.254: PROZ1.41 53.46,38.8 53.87,38.39 55.26,38.39 56.66,39.79 56.66,41.7 v58.31,43.35
  Bottom 0.254: v58.31,43.35 58.56,43.6 R49.1 59.07,43.79 D13.P$2
N$1  (via drill 0.2)
  Top 0.254: LED1.C v53.36,21.5
  Bottom 0.254: v53.36,21.5 53.36,20.74 R1.2
N$2  (via drill 0.2)
  Top 0.254: LED2.C 25.93,25.31 26.18,25.06 v26.18,23.16
  Bottom 0.254: v26.18,23.16 R2.2
N$3
  Bottom 0.254: R7.1 40.79,15.98 C5.1 40.91,15.79 40.79,15.66 40.79,14.33 R8.1
N$4  (via drill 0.2)
  Top 0.254: IC8.5 20.14,12.68 20.08,12.61 v20.08,12.36 | X13.3 19.19,19.99 v19.2,19.98
  Bottom 0.254: 20.08,11.92 C13.1 20.53,12.36 v20.08,12.36 19.58,12.36 19.2,12.74 v19.2,19.98
N$5
  Top 0.254: X10.P$3 84.18,13.8 X9.P$4
N$6  (via drill 0.2)
  Top 0.254: IC7.3 v78.25,47.91
  Bottom 1.016: 79.65,47.03 79.65,39.16 80.54,38.27 80.54,34.58 81.55,33.57 83.84,33.57 84.47,32.93 84.47,24.55 X11.P$1
  other vias: 79.77,47.91 79.01,47.91
  pour Bottom: 78,48.17 78,47.67 79.52,46.14 80.03,46.14 80.03,48.17
N$7  (via drill 0.2)
  Top 0.254: v5.86,21.25 X15.2
  Bottom 0.254: R26.1 4.34,22.77 v5.86,21.25
N$9  (via drill 0.2)
  Top 0.254: IC9.5 12.91,12.8 12.85,12.74 v12.85,12.36 | X14.3 12.45,19.99 v12.46,19.98
  Bottom 0.254: 12.85,11.92 C14.1 | 13.29,12.49 C14.1 | v12.46,19.98 12.46,15.92 11.96,15.41 11.96,12.61 12.21,12.36 v12.85,12.36 13.29,12.36 C14.1
N$10  (via drill 0.2)
  Top 0.254: 88.02,36.62 IC6.9 v88.53,36.62 v88.54,36.62
  Bottom 1.016: 89.17,35.73 89.17,10.33 X10.P$1
  other vias: 87.78,36.62 89.3,36.62
  pour Bottom: 87.52,36.87 87.52,36.49 89.55,34.46 89.55,36.87
N$11
  Top 0.254: X11.P$4 85.15,29.26 X12.P$3
N$12  (via drill 0.2)
  Top 0.254: IC6.3 v77.87,37.62
  Top 1.016: v78.63,32.55 78.63,17.44 80.16,15.92 80.16,10.33 X9.P$1
  Bottom 1.016: 78.63,36.74 v78.63,32.55 v78.63,31.92 v78.63,31.28
  other vias: 78.63,37.62 79.39,37.62
  pour Bottom: 77.61,37.89 77.61,37.38 78.63,36.36 79.65,37.38 79.65,37.89
N$13  (via drill 0.2)
  Top 0.254: IC7.9 87.4,46.91 v87.39,46.9
  Bottom 1.016: X12.P$1 86.12,23.28 86.12,31.54 87.27,32.68 87.27,34.97 86.25,35.98 86.25,41.82 88.16,43.73 88.16,46.01
  other vias: 88.16,46.9 88.92,46.9
  pour Bottom: 88.16,45.76 89.17,46.78 89.17,47.16 87.14,47.16 87.14,46.78
N$14
  Bottom 0.254: R10.1 76.03,22.01 76.03,22.96 75.33,23.66 75.33,25.82 JP1.1
N$15
  Bottom 0.254: C2.1 29.42,36.55 29.36,36.49 29.36,32.43 | IC2.3 30.83,32.43 29.36,32.43 | 29.36,32.43 29.36,29.76 28.85,29.25 28.85,27.47 25.42,24.04 21.35,24.04 S_CAN1.P$2
N$16
  Bottom 0.254: R36.1 18.52,51.73 Q6.1
N$17
  Bottom 0.254: R4.2 23.96,34.9 24.02,34.84 IC2.8
N$18
  Bottom 0.254: R5.1 47.07,16.3 C4.1 47.07,13.12 R6.1
N$19
  Bottom 0.254: 40.79,18.84 42.44,18.84 S_CAN1_ROFF.P$2
  Bottom 0.406: R7.2 40.79,18.84
N$20
  Bottom 0.254: IC1.8 36.09,34.84 35.32,35.6 35.32,36.8 R3.2
N$21
  Bottom 0.254: R5.2 46.82,18.39 46.63,18.58 S_CAN2_ROFF.P$2
N$22  (via drill 0.2)
  Top 0.254: Q1.1 77.17,7.85 77.11,7.92 v77.11,6.52
  Bottom 0.254: v77.11,6.52 IC5.10
N$23  (via drill 0.2)
  Top 0.254: 77.81,11.16 Q2.1 77.76,11.34 v78.63,11.34
  Bottom 0.254: IC5.6 78.38,11.6 v78.63,11.34
N$24
  Bottom 0.254: JP2.1 71.39,19.54 71.2,19.35 R15.1
N$25  (via drill 0.2)
  Top 0.254: v68.34,54.27 68.34,53.38 68.35,53.39 X16.3
  Bottom 0.254: R30.1 68.22,54.4 v68.34,54.27
N$26
  Top 0.254: R16.2 70.12,25.82 JP2.3
N$27
  Top 0.254: 76.34,22.9 76.6,23.16 R11.2 74.89,22.84 JP1.3
N$28  (via drill 0.2)
  Top 0.254: v55.52,21.5 LED5.C
  Bottom 0.254: R17.2 v55.52,21.5
N$29  (via drill 0.2)
  Top 0.254: v57.68,21.5 LED4.C
  Bottom 0.254: R14.2 v57.68,21.5
N$30  (via drill 0.2)
  Top 0.254: v59.84,21.5 LED3.C
  Bottom 0.254: R12.2 v59.84,21.5
N$31  (via drill 0.2)
  Top 0.254: v10.05,21.25 X14.2
  Bottom 0.254: R25.1 6.24,25.06 v10.05,21.25
N$32  (via drill 0.2)
  Top 0.254: IC10.5 6.17,12.93 6.11,12.87 v6.11,12.61 | v5.86,19.98 X15.3
  Bottom 0.254: 6.11,12.04 C15.1 | v5.86,19.98 5.86,16.17 5.22,15.54 5.22,13.12 5.73,12.61 v6.11,12.61 6.56,12.61 C15.1 | 6.43,12.74 C15.1
N$33  (via drill 0.2)
  Top 0.254: v14.37,21.25 X13.2
  Bottom 0.254: R24.1 8.15,26.33 10.94,23.54 13.35,23.54 14.37,22.52 v14.37,21.25
N$34
  Bottom 0.254: R40.1 16.91,7.41 17.29,7.03 17.29,6.16 Q9.1
N$35  (via drill 0.2)
  Top 0.254: v71.39,54.52 71.14,54.27 71.14,53.45 X16.1 70.85,53.1
  Bottom 0.254: R28.1 71.27,54.65 v71.39,54.52
N$36
  Bottom 0.254: Q3.1 81.36,19.28 R19.1
N$37
  Bottom 0.254: Q4.1 79.86,29.72 80.28,30.14 81.04,30.14 R22.1
N$38
  Bottom 0.254: R32.1 35.75,45.59 Q5.1
N$39  (via drill 0.2)
  Top 0.254: v37.48,41.06 37.48,29.38 37.61,29.25 48.66,29.25 v52.34,25.57 | v52.34,13.76 58.31,13.76 68.6,3.47 71.69,3.47 X17.P$3
  Bottom 0.254: v37.48,41.06 36.98,41.57 35.83,41.57 R33.2 R32.2 | v52.34,25.57 v52.34,13.76
N$40  (via drill 0.2)
  Top 0.254: v14.24,1.31 14.24,1.68 IC12.P$3
  Bottom 0.254: R45.1 13.99,3.34 14.24,3.09 v14.24,1.31
N$41
  Bottom 0.254: IC13.13 70.63,6.01 71.14,5.5 71.14,3.13 X17.P$2
N$42
  Bottom 0.254: IC13.2 66.31,6.01 66.57,5.76 66.57,2.58 66.82,2.33 X17.P$1
N$43
  Top 0.254: R41.1 12.21,1.56 IC12.P$1
N$44
  Bottom 0.254: R39.1 11.19,10.22 11.19,9.31 10.69,8.8 10.69,5.88 11.01,5.56 Q8.1
N$45
  Top 0.254: R37.1 0.91,30.12 Q7.1
N$50  (via drill 0.2)
  Top 0.254: IC12.P$6 12.33,3.6 12.46,3.47 15.39,3.47 15.89,3.98 R44.1
  Bottom 0.254: R44.1 16.02,3.85 R45.2
  other vias: 16.02,3.98
NALERT  (via drill 0.2)
  Top 0.254: v68.09,23.28 65.42,20.62 59.33,20.62 58.82,21.12 58.82,24.04 58.4,24.46 LED4.A v57.68,24.81 | PROZ1.35 53.46,41.8 54.63,42.97 v56.02,42.97
  Bottom 0.254: v68.09,23.28 IC4.9 | v56.02,42.97 56.66,42.33 56.66,34.2 58.82,32.04 58.82,25.95 v57.68,24.81
NALERT1
  Bottom 0.254: X5.P$7 61.61,32.54 61.61,28.51 IC4.1
NALERT2  (via drill 0.2)
  Top 0.254: v63.77,32.93 64.39,33.55 X6.P$7
  Bottom 0.254: IC4.2 63.01,29.63 63.77,30.39 v63.77,32.93
NALERT3
  Bottom 0.254: X7.P$7 72.65,33.55 70.12,31.03 70.12,24.17 69.36,23.41 IC4.8 69.39,22.27
NCS1  (via drill 0.2)
  Top 0.254: v47.64,51.86 50.69,48.81 58.06,48.81 60.81,46.05 X5.P$2
  Bottom 0.254: IC3.15 v47.64,51.86
NCS2  (via drill 0.2)
  Top 0.254: v46.75,52.49 47.9,52.49 51.07,49.32 58.44,49.32 60.47,47.28 67.37,47.28 X6.P$2
  Bottom 0.254: IC3.14 46.37,52.87 v46.75,52.49
NCS3  (via drill 0.2)
  Top 0.254: v45.48,53.13 48.02,53.13 51.33,49.82 70.8,49.82 X7.P$2
  Bottom 0.254: IC3.13 45.1,53.51 v45.48,53.13
NCS4  (via drill 0.2)
  Top 0.254: v43.83,53.76 48.15,53.76 51.58,50.33 76.6,50.33 v76.98,49.95 | v86.89,45.89 88.36,45.89 IC7.8
  Bottom 0.254: IC3.12 v43.83,53.76
  Bottom 0.279: v76.98,49.95 81.04,49.95 81.81,49.19 85.36,49.19 86,48.55 86,46.78 v86.89,45.89
NCS5  (via drill 0.2)
  Top 0.254: 89.15,35.62 IC6.8 89.53,35.62 90.06,36.16 90.06,50.59 88.79,51.86 77.61,51.86 76.6,50.84 51.83,50.84 48.28,54.4 43.2,54.4 v42.56,53.76
  Bottom 0.254: IC3.11 v42.56,53.76
NFAULT  (via drill 0.2)
  Top 0.254: v68.09,27.35 66.82,27.35 64.28,24.81 60.09,24.81 59.84,24.55 LED3.A 57.96,26.33 v55.26,26.33 | v67.45,16.42 67.45,15.92 68.22,15.15 73.93,15.15 v74.57,14.52 | PROZ1.53 v42.94,40.8
  Bottom 0.254: IC5.11 75.84,10.96 74.57,12.23 IC5.3 v74.57,14.52 | v67.45,16.42 67.45,23.66 68.09,24.3 v68.09,27.35 IC4.6 | v42.94,40.8 44.98,38.77 44.98,29.76 48.41,26.33 v55.26,26.33
NFAULT1
  Bottom 0.254: X5.P$6 63.83,36.05 64.53,35.35 64.53,29.76 64.28,29.5 IC4.3
NFAULT2
  Bottom 0.254: IC4.4 65.55,33.01 X6.P$6
NFAULT3
  Bottom 0.254: IC4.5 66.82,31.79 67.33,32.3 69.36,32.3 73.12,36.05 X7.P$6
NRST
  Top 0.254: PROZ1.17 4.85,40.8 X2.4
SCLK  (via drill 0.2)
  Top 0.254: v76.34,44.74 77.51,45.91 IC7.5 | IC6.5 78.76,35.6 v77.23,35.6 | X5.P$5 X6.P$5 X7.P$5 v76.34,38.55
  Bottom 0.254: v76.34,44.74 v76.34,38.55 76.34,36.11 76.85,35.6 v77.23,35.6 | X5.P$5 60.82,38.55 R47.2
SCLK_S  (via drill 0.2)
  Top 0.254: PROZ1.60 53.19,37.8 53.61,37.38 55.77,37.38 56.79,38.39 v58.31,38.39
  Bottom 0.254: D11.P$2 65.68,39.79 59.2,39.79 58.88,39.48 R47.1 58.76,38.39 v58.31,38.39
SLS_CO1  (via drill 0.2)
  Top 0.254: PROZ1.57 46.03,42.8 v44.98,43.86 | IC6.4 78.78,36.62 76.98,36.62 76.47,36.11 76.47,33.19 75.58,32.3 v56.91,32.3
  Bottom 0.254: v44.98,43.86 45.99,42.84 48.02,42.84 54.37,36.49 54.37,34.46 56.53,32.3 v56.91,32.3
SLS_RM  (via drill 0.2)
  Top 0.254: PROZ1.56 45.26,42.3 v44.47,43.09 | v57.04,31.03 58.18,29.89 v75.08,29.89
  Bottom 0.254: v44.47,43.09 45.23,42.33 47.77,42.33 53.87,36.24 53.87,34.2 v57.04,31.03 | v75.08,29.89 75.84,29.12 75.84,24.17 76.85,23.16 R18.1 77.87,23.28 | 77.87,23.28 77.87,18.46 77.74,18.33 Q3.3 | 77.87,23.41 77.87,23.28
SLS_RM_EX
  Bottom 0.254: R19.2 83.58,15.71 X9.P$3 84.93,13.8 R20.2
SPI_CS  (via drill 0.2)
  Top 0.254: PROZ1.38 v54.12,40.3
  Bottom 0.254: IC3.6 42.56,49.95 42.94,50.33 49.67,50.33 50.69,49.32 50.69,43.73 v54.12,40.3
TS1  (via drill 0.2)
  Top 0.254: PROZ1.40 53.6,39.3 53.87,39.03 54.74,39.03 v54.76,39.05 | v59.71,56.05 59.71,54.4 58.95,53.63 58.1,53.63 D9.P$2 57.08,53.68 v55.52,52.11
  Bottom 0.254: R30.2 68.15,56.62 C21.2 66.37,56.68 R29.1 60.34,56.68 v59.71,56.05 | v54.76,39.05 54.76,51.35 v55.52,52.11
TS2  (via drill 0.2)
  Top 0.254: PROZ1.39 53.73,39.8 53.87,39.66 v55.39,39.66 | v70,56.68 70,55.79 69.23,55.03 67.2,55.03 65.3,53.13 61.36,53.13 D10.P$2 61.36,52.11 60.72,51.48 v56.15,51.48
  Bottom 0.254: R27.1 R28.2 71.71,56.62 C20.2 v70,56.68 | v55.39,39.66 55.39,50.71 v56.15,51.48
USART_RXD  (via drill 0.2)
  Top 0.254: PROZ1.30 20.03,43.8 v20.46,44.24 | X2.10 4.97,48.3 6.75,48.3 7.38,48.94 v20.08,48.94
  Bottom 0.254: v20.08,48.94 20.46,48.55 v20.46,44.24
USART_TXD  (via drill 0.2)
  Top 0.254: PROZ1.28 20.8,43.3 v21.1,43.6 | X2.9 v21.1,49.57
  Bottom 0.254: v21.1,49.57 v21.1,43.6
VBAT  (via drill 0.2)
  Top 0.254: IC12.P$2 13.28,2.26 13.48,2.45 15.51,2.45 R44.2 v16.02,1.69 | C19.1 79.14,55.03 v79.52,55.41
  Route15 0.254: v53.1,1.69 v53.1,2.71 | v54.37,1.69 v54.37,2.71
  Bottom 0.254: v38.5,13.63 38,13.63 D2.C | R43.2 v19.83,9.82 | IC13.1 v65.68,4.74 | IC11.2 81.17,55.92 80.03,55.92 v79.52,55.41 | R42.2 14.24,8.3 v14.75,8.8 | v53.1,2.71 53.22,2.71 D1.C
  other vias: 38.5,12.61 37.48,12.61 37.48,13.63
  pour Route15 (no thermals): 90.5,0 90.5,31 87.5,31 86.5,32 86.5,50.5 87.5,51.5 90.5,51.5 90.5,58.5 79.5,58.5 79.5,53.5 81,52 81,8 80,7 64.5,7 63.5,8 63.5,12.5 62.5,13.5 21.5,13.5 20.5,12.5 0,12.5 0,0
VREF_PTC_CH  (via drill 0.2)
  Top 0.254: v75.2,54.78 76.28,54.78 C22.1 | 69.49,52.9 69.49,53.25 | 69.49,53.25 v69.49,54.27 | v66.95,53.51 66.95,53.32 X16.4 | X16.2 69.57,53.17 69.49,53.25
  Bottom 0.254: IC11.6 v75.2,54.78 | v66.95,53.51 66.95,54.27 66.5,54.72 C21.1 | C20.1 69.93,54.72 v69.49,54.27
  pour Route15: 65,58.5 65,54.5 66,53.5 78.5,53.5 78.5,58.5

## Text on the board
Bottom: BMS Ibex / V1.0 | bottom
tTest: BMS Ibex | Ladestecker / Temperatur | TERA TU Graz, April 2014 / Pöschl | GND | NCS | MOSI | MISO | CLK | FAULT | ALERT | Hauptschütz | 3V3 | First | 3V3 OK | R OFF | 5V | IL | ALERT | FAULT | Last | GND | Interlock | CAN 2 | 3V3 | Mot | RM | 12V | 5V | Schnell- / lader | VSS / CANH / CANL / GND | Lock
bTest: CAN / Transiver | GND | 12V